# Altium schematic sheet sheet4_power.SchDoc
size A4
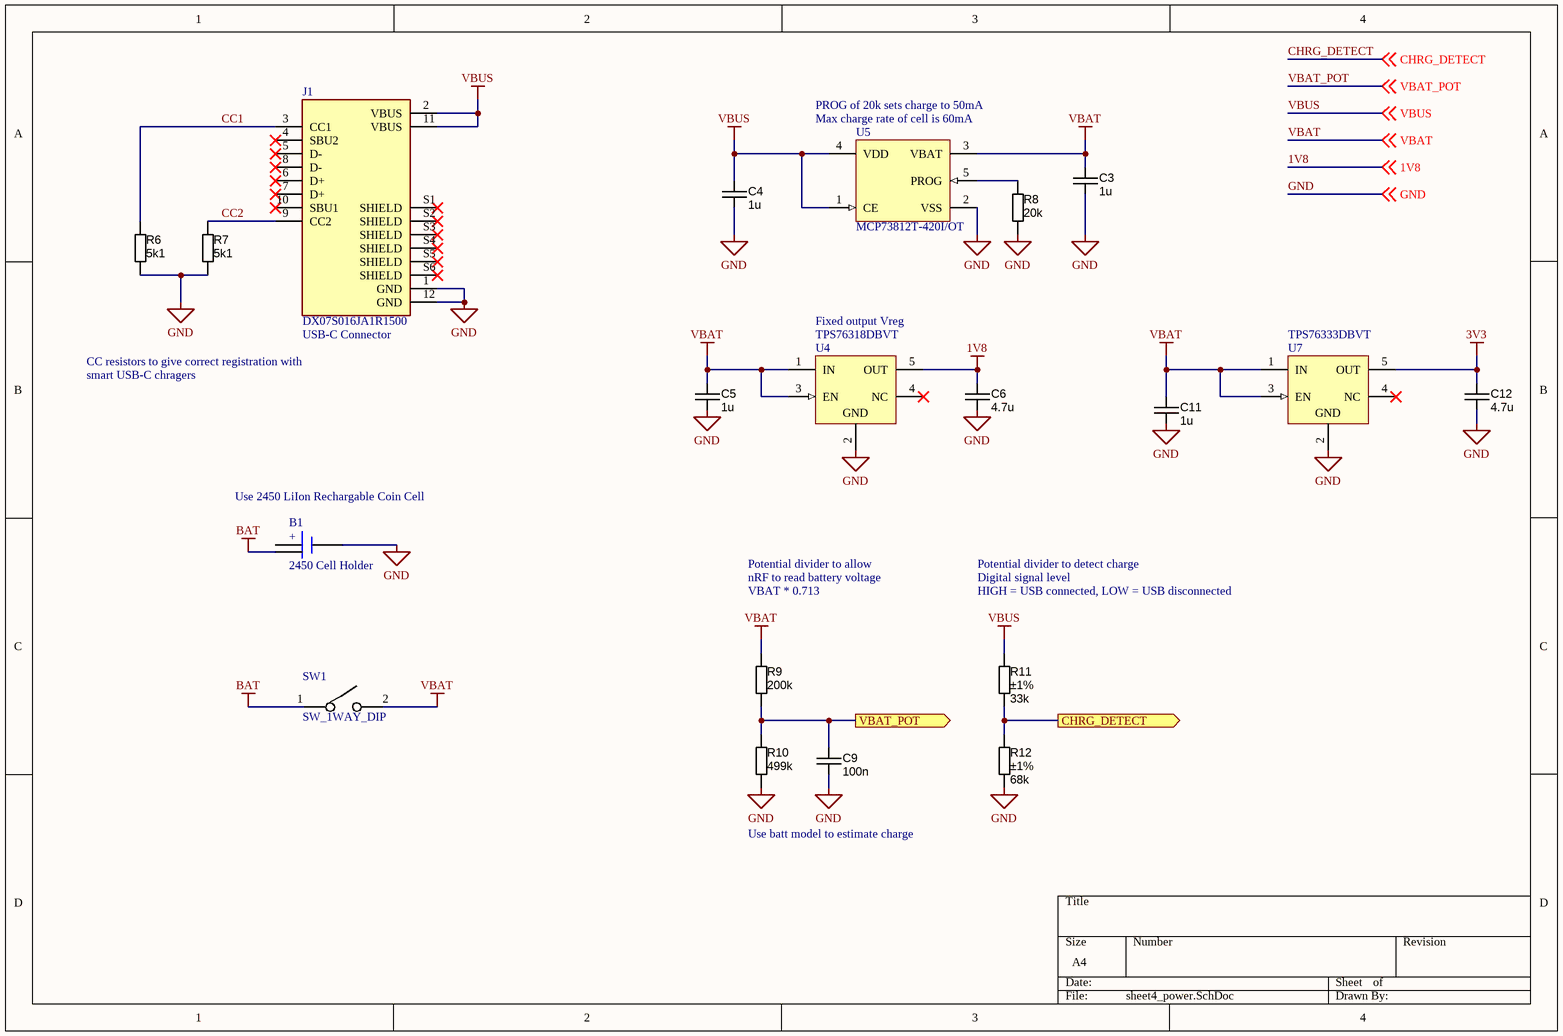
[diagram p0: sheet4_power.SchDoc]

## Parts
B1  2450 Cell Holder  [BC-2404]
C3  1u  [CAPC1005X55N]
C4  1u  [CAPC1005X55N]
C5  1u  [CAPC1005X55N]
C6  4.7u  [CAPC1005X55N]
C9  100n  [CAPC1005X55N]
C11  1u  [CAPC1005X55N]
C12  4.7u  [CAPC1005X55N]
J1  DX07S016JA1R1500  [JAE_DX07S016JA1R1500]
R6  value 5k1  [RESC1005X40N]  (hidden comment: Thick Film)
R7  value 5k1  [RESC1005X40N]  (hidden comment: Thick Film)
R8  value 20k  [RESC1005X40N]  (hidden comment: Thick Film)
R9  value 200k  [RESC1005X40N]  (hidden comment: Thick Film)
R10  value 499k  [RESC1005X40N]  (hidden comment: Thick Film)
R11  value 33k  Tolerance: ±1%  [RESC1608X55N]  (hidden comment: Thick Film)
R12  value 68k  Tolerance: ±1%  [RESC1608X55N]  (hidden comment: Thick Film)
SW1  SW_1WAY_DIP  [SW_1WAY]
U4  TPS76318DBVT  [TI-DBV5_N]
U5  MCP73812T-420I/OT  [SOT-23-OT5_N]
U7  TPS76333DBVT  [TI-DBV5_N]

## Ports
CHRG_DETECT (out), VBAT_POT (out)

## Nets
1V8: C6.1 U4.5(OUT) ; off-sheet 1V8
3V3: C12.1 U7.5(OUT)
BAT: B1.3(+) SW1.1
GND: B1.2(-) C3.2 C4.2 C5.2 C6.2 C9.2 C11.2 C12.2 J1.1(GND) J1.12(GND) R6.2 R7.2 R8.2 R10.2 R12.2 U4.2(GND) U5.2(VSS) U7.2(GND) ; off-sheet GND
VBAT: C3.1 C5.1 C11.1 R9.1 SW1.2 U4.1(IN) U4.3(EN) U5.3(VBAT) U7.1(IN) U7.3(EN) ; off-sheet VBAT
VBUS: C4.1 J1.2(VBUS) J1.11(VBUS) R11.1 U5.1(CE) U5.4(VDD) ; off-sheet VBUS
CC1: J1.3(CC1) R6.1
CC2: J1.9(CC2) R7.1
CHRG_DETECT: R11.2 R12.1 ; port CHRG_DETECT
CHRG_DETECT: off-sheet CHRG_DETECT  [a separate net that carries the same name]
VBAT_POT: C9.1 R9.2 R10.1 ; port VBAT_POT
VBAT_POT: off-sheet VBAT_POT  [a separate net that carries the same name]
NetR8_1: R8.1 U5.5(PROG)

Not connected (* = marked no-connect by the designer): B1 1(+); J1 4(SBU2)* 5(D-)* 6(D+)* 7(D+)* 8(D-)* 10(SBU1)* S1(SHIELD)* S2(SHIELD)* S3(SHIELD)* S4(SHIELD)* S5(SHIELD)* S6(SHIELD)*; U4 4(NC)*; U7 4(NC)*

## Notes on the sheet
- (near U5) PROG of 20k sets charge to 50mA
- (near U5) Max charge rate of cell is 60mA
- CC resistors to give correct registration with
- smart USB-C chragers
- (near J1) USB-C Connector
- (near U4) Fixed output Vreg
- (near B1) Use 2450 LiIon Rechargable Coin Cell
- Potential divider to allow
- nRF to read battery voltage
- Potential divider to detect charge
- Digital signal level
- VBAT * 0.713
- HIGH = USB connected, LOW = USB disconnected
- Use batt model to estimate charge

## Library data of the parts
B1 = 2450-LiIon: Multicomp BC-2404
C3-C5 C11 = CAPC_100n_0402_X5R_16V_10%: Capacitor SMD Cer 1uF 10% 16V X5R 0402; Manufacturer 1: AVX Corporation; Manufacturer Part Number 1: 0402YD104KAT2A; Ratings: 16V; X5R; SCDType: spec; Tolerance: ±10%; Operating Temperature: -55°C ~ 125°C; Package / Case: 0402 (1005 Metric); Size / Dimension: 0.039" L x 0.020" W (1.00mm x 0.50mm); Supplier 1: Digi-Key; Supplier Part Number 1: 478-1126-1-ND; ComponentLink1URL: http://www.avx.com/docs/Catalogs/cx5r.pdf; ComponentLink1Description: http://www.avx.com/docs/Catalogs/cx5r.pdf; Supplier 2: Digi-Key; Supplier Part Number 2: 311-1347-1-ND; Manufacturer 2: Yageo; Manufacturer Part Number 2: CC0402KRX5R7BB104; ComponentLink2URL: http://www.yageo.com/documents/recent/UPY-GPHC_X5R_4V-to-50V_12.pdf; ComponentLink2Description: http://www.yageo.com/documents/recent/UPY-GPHC_X5R_4V-to-50V_12.pdf; Value: 1u
C6 C12 = CAPC_100n_0402_X5R_16V_10%: Capacitor SMD Cer 4.7uF 10% 16V X5R 0402; Manufacturer 1: AVX Corporation; Manufacturer Part Number 1: 0402YD104KAT2A; Ratings: 16V; X5R; SCDType: spec; Tolerance: ±10%; Operating Temperature: -55°C ~ 125°C; Package / Case: 0402 (1005 Metric); Size / Dimension: 0.039" L x 0.020" W (1.00mm x 0.50mm); Supplier 1: Digi-Key; Supplier Part Number 1: 478-1126-1-ND; ComponentLink1URL: http://www.avx.com/docs/Catalogs/cx5r.pdf; ComponentLink1Description: http://www.avx.com/docs/Catalogs/cx5r.pdf; Supplier 2: Digi-Key; Supplier Part Number 2: 311-1347-1-ND; Manufacturer 2: Yageo; Manufacturer Part Number 2: CC0402KRX5R7BB104; ComponentLink2URL: http://www.yageo.com/documents/recent/UPY-GPHC_X5R_4V-to-50V_12.pdf; ComponentLink2Description: http://www.yageo.com/documents/recent/UPY-GPHC_X5R_4V-to-50V_12.pdf; Value: 4.7u
C9 = CAPC_100n_0402_X5R_16V_10%: Capacitor SMD Cer 100nF 10% 16V X5R 0402; Manufacturer 1: AVX Corporation; Manufacturer Part Number 1: 0402YD104KAT2A; Ratings: 16V; X5R; SCDType: spec; Tolerance: ±10%; Operating Temperature: -55°C ~ 125°C; Package / Case: 0402 (1005 Metric); Size / Dimension: 0.039" L x 0.020" W (1.00mm x 0.50mm); Supplier 1: Digi-Key; Supplier Part Number 1: 478-1126-1-ND; ComponentLink1URL: http://www.avx.com/docs/Catalogs/cx5r.pdf; ComponentLink1Description: http://www.avx.com/docs/Catalogs/cx5r.pdf; Supplier 2: Digi-Key; Supplier Part Number 2: 311-1347-1-ND; Manufacturer 2: Yageo; Manufacturer Part Number 2: CC0402KRX5R7BB104; ComponentLink2URL: http://www.yageo.com/documents/recent/UPY-GPHC_X5R_4V-to-50V_12.pdf; ComponentLink2Description: http://www.yageo.com/documents/recent/UPY-GPHC_X5R_4V-to-50V_12.pdf; Value: 100n
J1 = DX07S016JA1R1500: USB-C (USB TYPE-C) USB 2.0 Receptacle Connector 24 (16+8 Dummy) Position Surface Mount, Right Angle; Through Hole; MF: JAE Electronics; Value: *; Price: None; Package: None; Availability: Unavailable; MP: DX07S016JA1R1500; DigiKey-Purchase-URL: https://snapeda.com/shop?store=DigiKey&id=4551013; SnapEDA_Link: https://www.snapeda.com/parts/DX07S016JA1R1500/JAE%20Electronics/view-part/4551013/?ref=snap
R6 R7 = RES_3K3_0402_5%: Resistor SMD chip 5.1k Ohm 0.063W 5% 0402; Manufacturer 1: Yageo; Manufacturer Part Number 1: RC0402JR-073K3L; Ratings: 1/16 W; SCDType: spec; Package / Case: 0402 (1005 metric); Tolerance: ±5%; Material: Thick Film; Supplier 1: Digi-Key; Supplier Part Number 1: 311-3.3KJRCT-ND; ComponentLink1URL: http://www.yageo.com/documents/recent/PYu-RC0402_51_RoHS_L_6.pdf; ComponentLink1Description: http://www.yageo.com/documents/recent/PYu-RC0402_51_RoHS_L_6.pdf
R8 = RES_3K3_0402_5%: Resistor SMD chip 20k Ohm 0.063W 5% 0402; Manufacturer 1: Yageo; Manufacturer Part Number 1: RC0402JR-073K3L; Ratings: 1/16 W; SCDType: spec; Package / Case: 0402 (1005 metric); Tolerance: ±5%; Material: Thick Film; Supplier 1: Digi-Key; Supplier Part Number 1: 311-3.3KJRCT-ND; ComponentLink1URL: http://www.yageo.com/documents/recent/PYu-RC0402_51_RoHS_L_6.pdf; ComponentLink1Description: http://www.yageo.com/documents/recent/PYu-RC0402_51_RoHS_L_6.pdf
R9 = RES_3K3_0402_5%: Resistor SMD chip 2.4 MOhm 0.063W 5% 0402; Manufacturer 1: Yageo; Manufacturer Part Number 1: RC0402JR-073K3L; Ratings: 1/16 W; SCDType: spec; Package / Case: 0402 (1005 metric); Tolerance: ±5%; Material: Thick Film; Supplier 1: Digi-Key; Supplier Part Number 1: 311-3.3KJRCT-ND; ComponentLink1URL: http://www.yageo.com/documents/recent/PYu-RC0402_51_RoHS_L_6.pdf; ComponentLink1Description: http://www.yageo.com/documents/recent/PYu-RC0402_51_RoHS_L_6.pdf
R10 = RES_3K3_0402_5%: Resistor SMD chip 7.5 MOhm 0.063W 5% 0402; Manufacturer 1: Yageo; Manufacturer Part Number 1: RC0402JR-073K3L; Ratings: 1/16 W; SCDType: spec; Package / Case: 0402 (1005 metric); Tolerance: ±5%; Material: Thick Film; Supplier 1: Digi-Key; Supplier Part Number 1: 311-3.3KJRCT-ND; ComponentLink1URL: http://www.yageo.com/documents/recent/PYu-RC0402_51_RoHS_L_6.pdf; ComponentLink1Description: http://www.yageo.com/documents/recent/PYu-RC0402_51_RoHS_L_6.pdf
R11 = RES_10K_0603_1%: Resistor SMD chip 33k Ohm 0.1W 1% 0603; Manufacturer 1: Yageo; Manufacturer Part Number 1: RC0603FR-0710KL; Ratings: 1/10W; SCDType: spec; Package / Case: 0603 (1608 Metric); Supplier 1: Digi-Key; Supplier Part Number 1: 311-10.0KHRCT-ND
R12 = RES_10K_0603_1%: Resistor SMD chip 68k Ohm 0.1W 1% 0603; Manufacturer 1: Yageo; Manufacturer Part Number 1: RC0603FR-0710KL; Ratings: 1/10W; SCDType: spec; Package / Case: 0603 (1608 Metric); Supplier 1: Digi-Key; Supplier Part Number 1: 311-10.0KHRCT-ND
U4 = TPS76318DBVT: Single Output LDO, 150 mA, Fixed 1.8 V Output, 2.7 to 10 V Input, with Low IQ, 5-pin SOT-23 (DBV), -40 to 125 degC, Green (RoHS & no Sb/Br); Manufacturer: Texas Instruments; Accuracy(%): 3; Fixed Output Options(V): 1.8; Iout(Max)(A): 0.15; Iq(Typ)(mA): 0.08; SubFamily: Single Channel LDO; Vdo(Typ)(mV): 300; Vin(Max)(V): 10; Vin(Min)(V): 2.7; DatasheetVersion: SLVS181H; PackageVersion: 4073253-4/K; PackageReference: DBV5; PackageDescription: 5-Pin Plastic Small Outline, Body 1.60 Ã— 2.90 mm, Pitch 0.95 mm; Supplier 1: Digi-Key; Supplier Part Number 1: 296-2700-2-ND; Supplier 2: Digi-Key; Supplier Part Number 2: 296-2700-1-ND; Supplier 3: Digi-Key; Supplier Part Number 3: 296-2700-6-ND; Supplier 4: Farnell; Supplier Part Number 4: 8461341RL; Supplier 5: Farnell; Supplier Part Number 5: 8461341; Supplier 6: Newark; Supplier Part Number 6: 96C8608; Supplier 7: Mouser; Supplier Part Number 7: 595-TPS76318DBVT; Eco-Plan: Green (RoHS & no Sb/Br); Vout Adj(Max)(V): 1.8; Vout Adj(Min)(V): 1.8; Mounting Technology: Surface Mount; Code_JEDEC: MO-178; PartNumber: TPS76318DBVT; ComponentLink1Description: Manufacturer URL; ComponentLink1URL: http://www.ti.com/; ComponentLink2Description: Datasheet; ComponentLink2URL: http://www.ti.com/general/docs/lit/getliterature.tsp?genericPartNumber=TPS76318&fileType=pdf; ComponentLink3Description: Package Specification; ComponentLink3URL: http://www.ti.com/litv/pdf/mpds018i
U5 = MCP73812T-420I/OT: Simple, Miniature Single-Cell, Fully Integrated Li-Ion/Li-Polymer Charge Management Controller, 4.2V, 5-Pin SOT-23, Industrial Temperature, Tape and Reel; Manufacturer: Microchip; DatasheetVersion: revB, Sep-2007; PackageVersion: revBB, Aug-2009; PackageReference: SOT-23-OT5; PackageDescription: 5-Lead Plastic Small Outline Transistor (OT) [SOT-23]; Supplier 1: Digi-Key; Supplier Part Number 1: MCP73812T-420I/OTTR-ND; Supplier 2: Digi-Key; Supplier Part Number 2: MCP73812T-420I/OTCT-ND; Supplier 3: Digi-Key; Supplier Part Number 3: MCP73812T-420I/OTDKR-ND; Supplier 4: Farnell; Supplier Part Number 4: 1627187RL; Supplier 5: Farnell; Supplier Part Number 5: 1627187; Supplier 6: Newark; Supplier Part Number 6: 27M0232; Mounting Technology: Surface Mount; Code_IPC: SOT23-5; PartNumber: MCP73812T-420I/OT; ComponentLink1Description: Manufacturer URL; ComponentLink1URL: http://www.microchip.com/; ComponentLink2Description: Datasheet; ComponentLink2URL: http://ww1.microchip.com/downloads/en/DeviceDoc/22036b.pdf; ComponentLink3Description: Package Specification; ComponentLink3URL: http://www.microchip.com/stellent/groups/techpub_sg/documents/packagingspec/en012702.pdf; Supplier 7: Mouser; Supplier Part Number 7: 579-MCP73812T-420IOT
U7 = TPS76333DBVT: Single Output LDO, 150 mA, Fixed 3.3 V Output, 2.7 to 10 V Input, with Low IQ, 5-pin SOT-23 (DBV), -40 to 125 degC, Green (RoHS & no Sb/Br); Manufacturer: Texas Instruments; Accuracy(%): 3; Fixed Output Options(V): 3.3; Iout(Max)(A): 0.15; Iq(Typ)(mA): 0.08; SubFamily: Single Channel LDO; Vdo(Typ)(mV): 300; Vin(Max)(V): 10; Vin(Min)(V): 2.7; DatasheetVersion: SLVS181H; PackageVersion: 4073253-4/K; PackageReference: DBV5; PackageDescription: 5-Pin Plastic Small Outline, Body 1.60 Ã— 2.90 mm, Pitch 0.95 mm; Supplier 1: Digi-Key; Supplier Part Number 1: 296-2705-2-ND; Supplier 2: Digi-Key; Supplier Part Number 2: 296-2705-1-ND; Supplier 3: Digi-Key; Supplier Part Number 3: 296-2705-6-ND; Supplier 4: Farnell; Supplier Part Number 4: 8461376; Supplier 5: Farnell; Supplier Part Number 5: 8461376RL; Supplier 6: Newark; Supplier Part Number 6: 96C8605; Supplier 7: Mouser; Supplier Part Number 7: 595-TPS76333DBVT; Eco-Plan: Green (RoHS & no Sb/Br); Vout Adj(Max)(V): 3.3; Vout Adj(Min)(V): 3.3; Mounting Technology: Surface Mount; Code_JEDEC: MO-178; PartNumber: TPS76333DBVT; ComponentLink1Description: Manufacturer URL; ComponentLink1URL: http://www.ti.com/; ComponentLink2Description: Datasheet; ComponentLink2URL: http://www.ti.com/general/docs/lit/getliterature.tsp?genericPartNumber=TPS76333&fileType=pdf; ComponentLink3Description: Package Specification; ComponentLink3URL: http://www.ti.com/litv/pdf/mpds018i